# Altium schematic sheet DDR3B.SchDoc: HPBI Controller
size B; ApprovedBy: J Johnson; CheckedBy: J Johnson; Author: sdfasdfdfAEFfasdFfaF; DrawnBy: J Johnson; Organization: Opsero Electronic Design; Address1: 21-915 Av. Marguerite-Bourgeoys; Address2: Québec (QC); Address3: G1S 3X4; DocumentNumber: OP009-001-SCH; Revision: 1.0; SheetNumber: 04; SheetTotal: 16; Tel1: (581) 308-8830; Tel2: (581) 308-8830; Project: HPBI Controller; CheckedDate: 2013-12-13; Sheet: DDR3 SDRAM Page 2; PageSetup: Record=PageOptions|CenterHorizontal=True|CenterVertical=True|PrintScale=1.08|XCorrection=1.00|YCorrection=1.00|PrintKind=0|BorderSize=5000000|LeftOffset=0|BottomOffset=0|Orientation=2|PaperLength=1000|PaperWidth=1000|Scale=100|PaperSource=7|PrintQuality=-4|MediaType=1|DitherType=10|PaperKind=Tabloid     [11 x 17 in]|PrintScaleMode=1; DrawDate: 2013-12-13; SchTitle: HPBI Controller; RevDescription: Preliminary; RevDate: 2014-01-29; RevBy: J Johnson
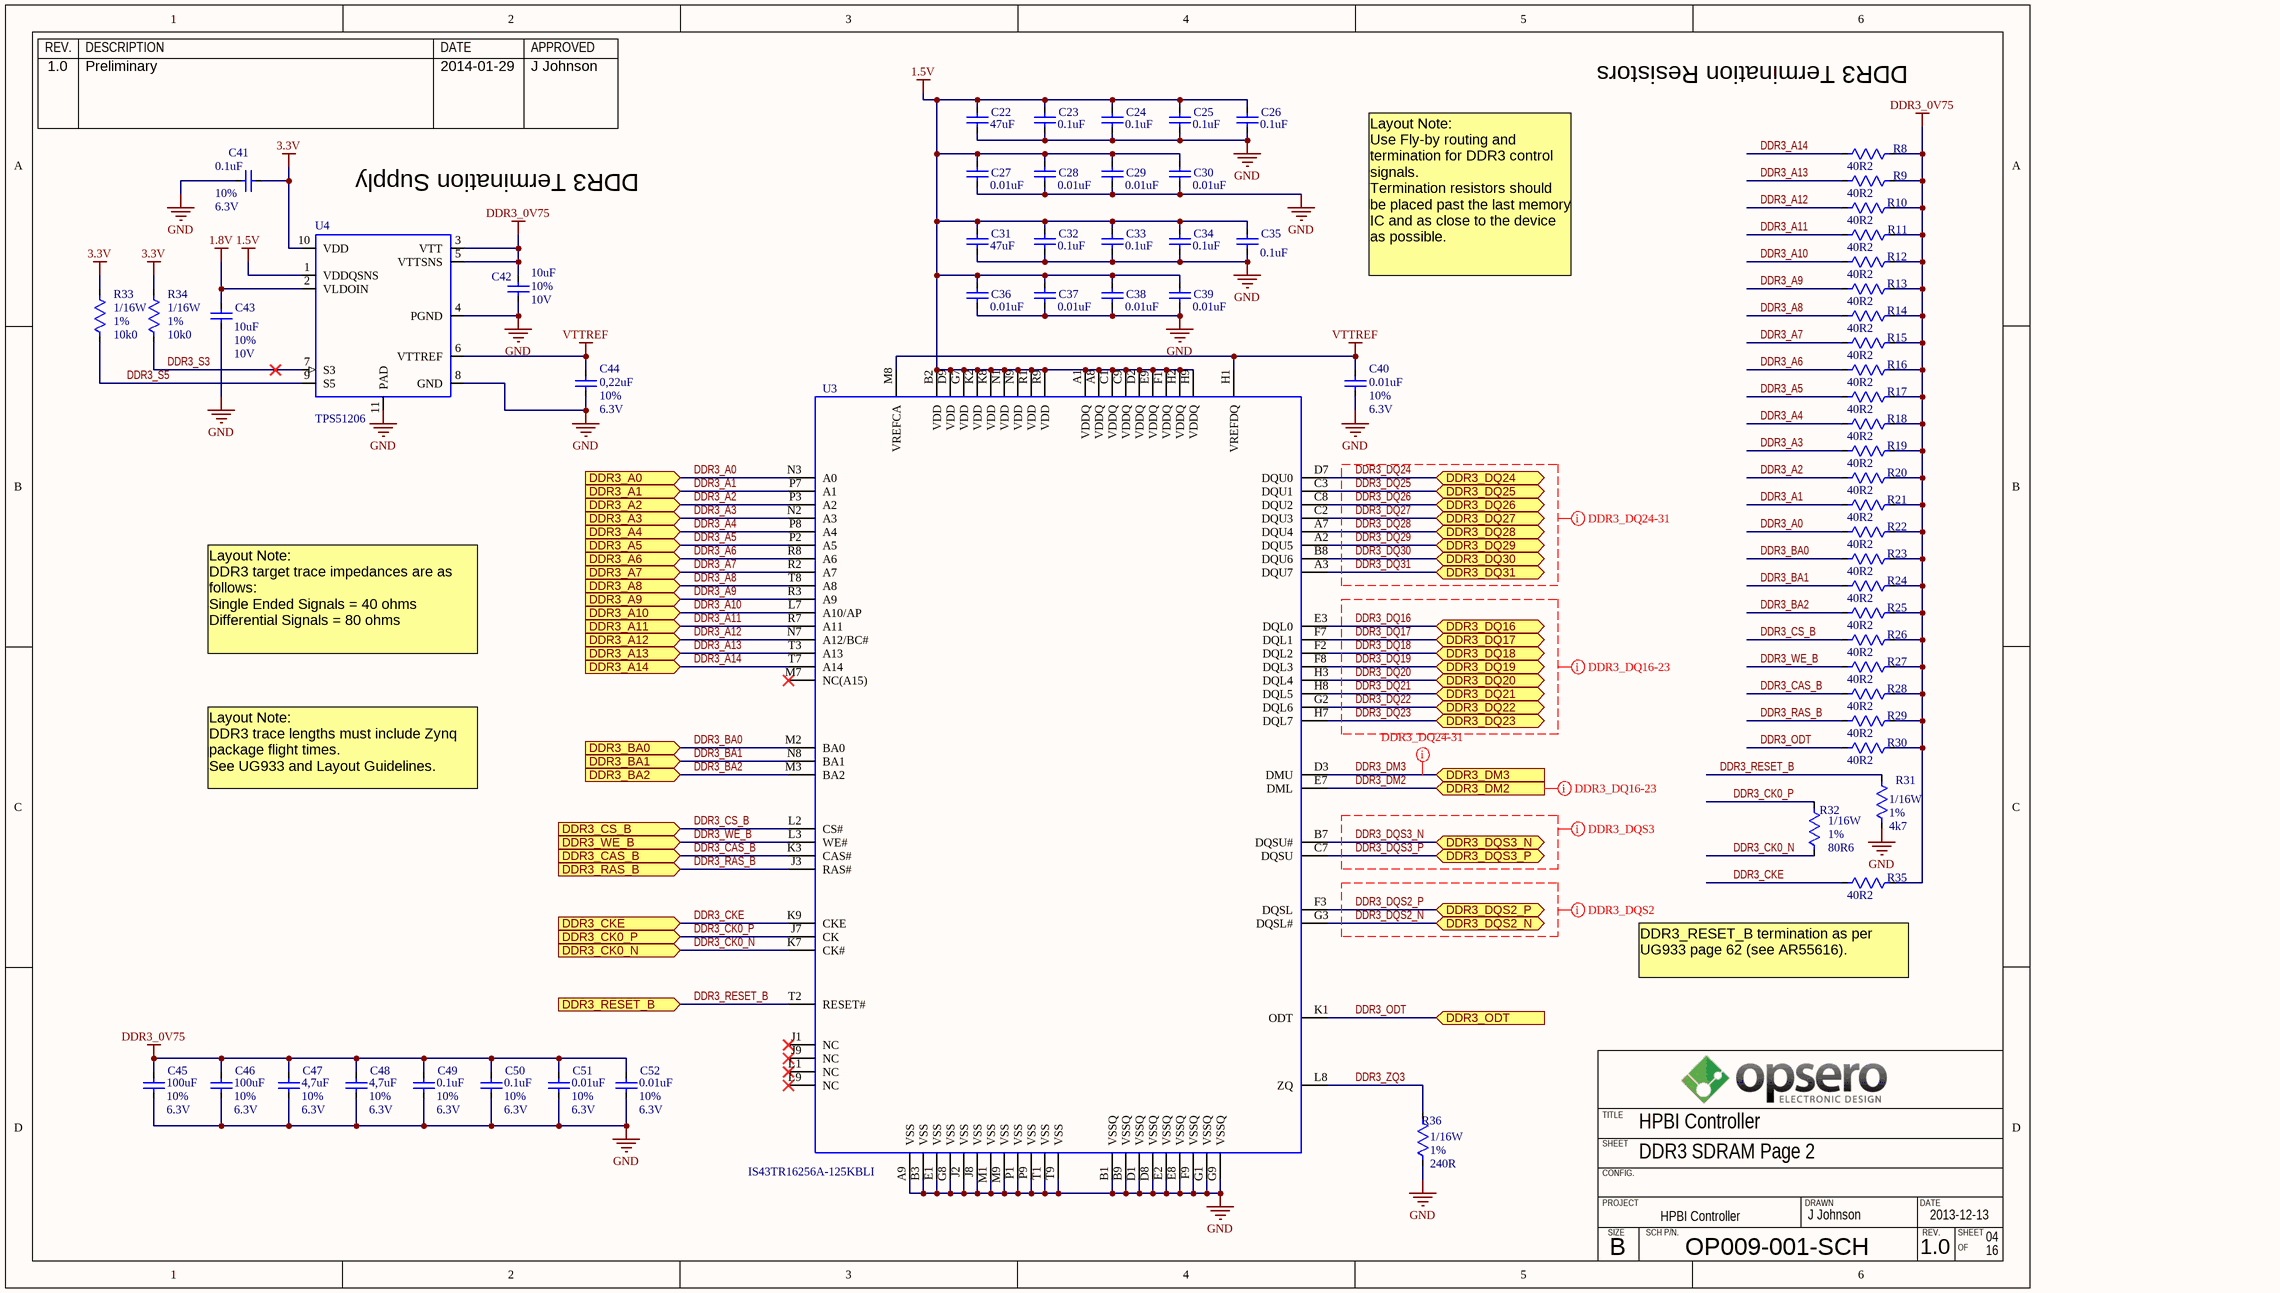
[diagram p0: DDR3B.SchDoc]

## Parts
C22  value 47uF  [CAPC2013X125N]  (hidden comment: CAPACITOR_NP_TYPE1)
C23  value 0.1uF  [CAPC0603X33N]  (hidden comment: CAPACITOR_NP_TYPE1)
C24  value 0.1uF  [CAPC0603X33N]  (hidden comment: CAPACITOR_NP_TYPE1)
C25  value 0.1uF  [CAPC0603X33N]  (hidden comment: CAPACITOR_NP_TYPE1)
C26  value 0.1uF  [CAPC0603X33N]  (hidden comment: CAPACITOR_NP_TYPE1)
C27  value 0.01uF  [CAPC0603X33N]  (hidden comment: CAPACITOR_NP_TYPE1)
C28  value 0.01uF  [CAPC0603X33N]  (hidden comment: CAPACITOR_NP_TYPE1)
C29  value 0.01uF  [CAPC0603X33N]  (hidden comment: CAPACITOR_NP_TYPE1)
C30  value 0.01uF  [CAPC0603X33N]  (hidden comment: CAPACITOR_NP_TYPE1)
C31  value 47uF  [CAPC2013X125N]  (hidden comment: CAPACITOR_NP_TYPE1)
C32  value 0.1uF  [CAPC0603X33N]  (hidden comment: CAPACITOR_NP_TYPE1)
C33  value 0.1uF  [CAPC0603X33N]  (hidden comment: CAPACITOR_NP_TYPE1)
C34  value 0.1uF  [CAPC0603X33N]  (hidden comment: CAPACITOR_NP_TYPE1)
C35  value 0.1uF  [CAPC0603X33N]  (hidden comment: CAPACITOR_NP_TYPE1)
C36  value 0.01uF  [CAPC0603X33N]  (hidden comment: CAPACITOR_NP_TYPE1)
C37  value 0.01uF  [CAPC0603X33N]  (hidden comment: CAPACITOR_NP_TYPE1)
C38  value 0.01uF  [CAPC0603X33N]  (hidden comment: CAPACITOR_NP_TYPE1)
C39  value 0.01uF  [CAPC0603X33N]  (hidden comment: CAPACITOR_NP_TYPE1)
C40  value 0.01uF  Tolerance: 10%  Voltage: 6.3V  [CAPC0603X33N]  (hidden comment: CAPACITOR_NP_TYPE1)
C41  value 0.1uF  Tolerance: 10%  Voltage: 6.3V  [CAPC0603X33N]  (hidden comment: CAPACITOR_NP_TYPE1)
C42  value 10uF  Tolerance: 10%  Voltage: 10V  [CAPC1608X38N]  (hidden comment: CAPACITOR_NP_TYPE1)
C43  value 10uF  Tolerance: 10%  Voltage: 10V  [CAPC1608X38N]  (hidden comment: CAPACITOR_NP_TYPE1)
C44  value 0,22uF  Tolerance: 10%  Voltage: 6.3V  [CAPC1005X55N]  (hidden comment: CAPACITOR_NP_TYPE1)
C45  value 100uF  Tolerance: 10%  Voltage: 6.3V  [CAPC3225X250N]  (hidden comment: CAPACITOR_NP_TYPE1)
C46  value 100uF  Tolerance: 10%  Voltage: 6.3V  [CAPC3225X250N]  (hidden comment: CAPACITOR_NP_TYPE1)
C47  value 4,7uF  Tolerance: 10%  Voltage: 6.3V  [CAPC1005X33N]  (hidden comment: CAPACITOR_NP_TYPE1)
C48  value 4,7uF  Tolerance: 10%  Voltage: 6.3V  [CAPC1005X33N]  (hidden comment: CAPACITOR_NP_TYPE1)
C49  value 0.1uF  Tolerance: 10%  Voltage: 6.3V  [CAPC0603X33N]  (hidden comment: CAPACITOR_NP_TYPE1)
C50  value 0.1uF  Tolerance: 10%  Voltage: 6.3V  [CAPC0603X33N]  (hidden comment: CAPACITOR_NP_TYPE1)
C51  value 0.01uF  Tolerance: 10%  Voltage: 6.3V  [CAPC0603X33N]  (hidden comment: CAPACITOR_NP_TYPE1)
C52  value 0.01uF  Tolerance: 10%  Voltage: 6.3V  [CAPC0603X33N]  (hidden comment: CAPACITOR_NP_TYPE1)
R8  value 40R2  [RESC1005X33N]  (hidden comment: *)
R9  value 40R2  [RESC1005X33N]  (hidden comment: *)
R10  value 40R2  [RESC1005X33N]  (hidden comment: *)
R11  value 40R2  [RESC1005X33N]  (hidden comment: *)
R12  value 40R2  [RESC1005X33N]  (hidden comment: *)
R13  value 40R2  [RESC1005X33N]  (hidden comment: *)
R14  value 40R2  [RESC1005X33N]  (hidden comment: *)
R15  value 40R2  [RESC1005X33N]  (hidden comment: *)
R16  value 40R2  [RESC1005X33N]  (hidden comment: *)
R17  value 40R2  [RESC1005X33N]  (hidden comment: *)
R18  value 40R2  [RESC1005X33N]  (hidden comment: *)
R19  value 40R2  [RESC1005X33N]  (hidden comment: *)
R20  value 40R2  [RESC1005X33N]  (hidden comment: *)
R21  value 40R2  [RESC1005X33N]  (hidden comment: *)
R22  value 40R2  [RESC1005X33N]  (hidden comment: *)
R23  value 40R2  [RESC1005X33N]  (hidden comment: *)
R24  value 40R2  [RESC1005X33N]  (hidden comment: *)
R25  value 40R2  [RESC1005X33N]  (hidden comment: *)
R26  value 40R2  [RESC1005X33N]  (hidden comment: *)
R27  value 40R2  [RESC1005X33N]  (hidden comment: *)
R28  value 40R2  [RESC1005X33N]  (hidden comment: *)
R29  value 40R2  [RESC1005X33N]  (hidden comment: *)
R30  value 40R2  [RESC1005X33N]  (hidden comment: *)
R31  value 4k7  Power: 1/16W  Tolerance: 1%  [RESC1005X33N]  (hidden comment: *)
R32  value 80R6  Power: 1/16W  Tolerance: 1%  [RESC1005X33N]  (hidden comment: *)
R33  value 10k0  Power: 1/16W  Tolerance: 1%  [RESC1005X33N]  (hidden comment: *)
R34  value 10k0  Power: 1/16W  Tolerance: 1%  [RESC1005X33N]  (hidden comment: *)
R35  value 40R2  [RESC1005X33N]  (hidden comment: *)
R36  value 240R  Power: 1/16W  Tolerance: 1%  [RESC1005X33N]  (hidden comment: *)
U3  IS43TR16256A-125KBLI  [BGA96C80P6X16_900X1300X120]
U4  TPS51206  [DFN40P200X200X75-11N]

## Ports
DDR3_A0 (in), DDR3_A1 (in), DDR3_A2 (in), DDR3_A3 (in), DDR3_A4 (in), DDR3_A5 (in), DDR3_A6 (in), DDR3_A7 (in), DDR3_A8 (in), DDR3_A9 (in), DDR3_A10 (in), DDR3_A11 (in), DDR3_A12 (in), DDR3_A13 (in), DDR3_A14 (in), DDR3_BA0 (in), DDR3_BA1 (in), DDR3_BA2 (in), DDR3_CAS_B (in), DDR3_CK0_N (in), DDR3_CK0_P (in), DDR3_CKE (in), DDR3_CS_B (in), DDR3_DM2 (in), DDR3_DM3 (in), DDR3_DQ16 (bidir), DDR3_DQ17 (bidir), DDR3_DQ18 (bidir), DDR3_DQ19 (bidir), DDR3_DQ20 (bidir), DDR3_DQ21 (bidir), DDR3_DQ22 (bidir), DDR3_DQ23 (bidir), DDR3_DQ24 (bidir), DDR3_DQ25 (bidir), DDR3_DQ26 (bidir), DDR3_DQ27 (bidir), DDR3_DQ28 (bidir), DDR3_DQ29 (bidir), DDR3_DQ30 (bidir), DDR3_DQ31 (bidir), DDR3_DQS2_N (bidir), DDR3_DQS2_P (bidir), DDR3_DQS3_N (bidir), DDR3_DQS3_P (bidir), DDR3_ODT (in), DDR3_RAS_B (in), DDR3_RESET_B (in), DDR3_WE_B (in)

## Nets
1.5V: C22.1 C23.1 C24.1 C25.1 C26.1 C27.1 C28.1 C29.1 C30.1 C31.1 C32.1 C33.1 C34.1 C35.1 C36.1 C37.1 C38.1 C39.1 U3.A1(VDDQ) U3.A8(VDDQ) U3.B2(VDD) U3.C1(VDDQ) U3.C9(VDDQ) U3.D2(VDDQ) U3.D9(VDD) U3.E9(VDDQ) U3.F1(VDDQ) U3.G7(VDD) U3.H2(VDDQ) U3.H9(VDDQ) U3.K2(VDD) U3.K8(VDD) U3.N1(VDD) U3.N9(VDD) U3.R1(VDD) U3.R9(VDD) U4.1(VDDQSNS)
1.8V: C43.1 U4.2(VLDOIN)
3.3V: C41.1 R33.1 R34.1 U4.10(VDD)
DDR3_0V75: C42.1 C45.1 C46.1 C47.1 C48.1 C49.1 C50.1 C51.1 C52.1 R8.1 R9.1 R10.1 R11.1 R12.1 R13.1 R14.1 R15.1 R16.1 R17.1 R18.1 R19.1 R20.1 R21.1 R22.1 R23.1 R24.1 R25.1 R26.1 R27.1 R28.1 R29.1 R30.1 R35.1 U4.3(VTT) U4.5(VTTSNS)
GND: C22.2 C23.2 C24.2 C25.2 C26.2 C27.2 C28.2 C29.2 C30.2 C31.2 C32.2 C33.2 C34.2 C35.2 C36.2 C37.2 C38.2 C39.2 C40.2 C41.2 C42.2 C43.2 C44.2 C45.2 C46.2 C47.2 C48.2 C49.2 C50.2 C51.2 C52.2 R31.2 R36.1 U3.A9(VSS) U3.B1(VSSQ) U3.B3(VSS) U3.B9(VSSQ) U3.D1(VSSQ) U3.D8(VSSQ) U3.E1(VSS) U3.E2(VSSQ) U3.E8(VSSQ) U3.F9(VSSQ) U3.G1(VSSQ) U3.G8(VSS) U3.G9(VSSQ) U3.J2(VSS) U3.J8(VSS) U3.M1(VSS) U3.M9(VSS) U3.P1(VSS) U3.P9(VSS) U3.T1(VSS) U3.T9(VSS) U4.4(PGND) U4.8(GND) U4.11(PAD)
VTTREF: C40.1 C44.1 U3.H1(VREFDQ) U3.M8(VREFCA) U4.6(VTTREF)
DDR3_A0: R22.2 U3.N3(A0) ; port DDR3_A0
DDR3_A1: R21.2 U3.P7(A1) ; port DDR3_A1
DDR3_A2: R20.2 U3.P3(A2) ; port DDR3_A2
DDR3_A3: R19.2 U3.N2(A3) ; port DDR3_A3
DDR3_A4: R18.2 U3.P8(A4) ; port DDR3_A4
DDR3_A5: R17.2 U3.P2(A5) ; port DDR3_A5
DDR3_A6: R16.2 U3.R8(A6) ; port DDR3_A6
DDR3_A7: R15.2 U3.R2(A7) ; port DDR3_A7
DDR3_A8: R14.2 U3.T8(A8) ; port DDR3_A8
DDR3_A9: R13.2 U3.R3(A9) ; port DDR3_A9
DDR3_A10: R12.2 U3.L7(A10/AP) ; port DDR3_A10
DDR3_A11: R11.2 U3.R7(A11) ; port DDR3_A11
DDR3_A12: R10.2 U3.N7(A12/BC#) ; port DDR3_A12
DDR3_A13: R9.2 U3.T3(A13) ; port DDR3_A13
DDR3_A14: R8.2 U3.T7(A14) ; port DDR3_A14
DDR3_BA0: R23.2 U3.M2(BA0) ; port DDR3_BA0
DDR3_BA1: R24.2 U3.N8(BA1) ; port DDR3_BA1
DDR3_BA2: R25.2 U3.M3(BA2) ; port DDR3_BA2
DDR3_CAS_B: R28.2 U3.K3(CAS#) ; port DDR3_CAS_B
DDR3_CK0_N: R32.1 U3.K7(CK#) ; port DDR3_CK0_N
DDR3_CK0_P: R32.2 U3.J7(CK) ; port DDR3_CK0_P
DDR3_CKE: R35.2 U3.K9(CKE) ; port DDR3_CKE
DDR3_CS_B: R26.2 U3.L2(CS#) ; port DDR3_CS_B
DDR3_DM2: U3.E7(DML) ; port DDR3_DM2
DDR3_DM3: U3.D3(DMU) ; port DDR3_DM3
DDR3_DQ16: U3.E3(DQL0) ; port DDR3_DQ16
DDR3_DQ17: U3.F7(DQL1) ; port DDR3_DQ17
DDR3_DQ18: U3.F2(DQL2) ; port DDR3_DQ18
DDR3_DQ19: U3.F8(DQL3) ; port DDR3_DQ19
DDR3_DQ20: U3.H3(DQL4) ; port DDR3_DQ20
DDR3_DQ21: U3.H8(DQL5) ; port DDR3_DQ21
DDR3_DQ22: U3.G2(DQL6) ; port DDR3_DQ22
DDR3_DQ23: U3.H7(DQL7) ; port DDR3_DQ23
DDR3_DQ24: U3.D7(DQU0) ; port DDR3_DQ24
DDR3_DQ25: U3.C3(DQU1) ; port DDR3_DQ25
DDR3_DQ26: U3.C8(DQU2) ; port DDR3_DQ26
DDR3_DQ27: U3.C2(DQU3) ; port DDR3_DQ27
DDR3_DQ28: U3.A7(DQU4) ; port DDR3_DQ28
DDR3_DQ29: U3.A2(DQU5) ; port DDR3_DQ29
DDR3_DQ30: U3.B8(DQU6) ; port DDR3_DQ30
DDR3_DQ31: U3.A3(DQU7) ; port DDR3_DQ31
DDR3_DQS2_N: U3.G3(DQSL#) ; port DDR3_DQS2_N
DDR3_DQS2_P: U3.F3(DQSL) ; port DDR3_DQS2_P
DDR3_DQS3_N: U3.B7(DQSU#) ; port DDR3_DQS3_N
DDR3_DQS3_P: U3.C7(DQSU) ; port DDR3_DQS3_P
DDR3_ODT: R30.2 U3.K1(ODT) ; port DDR3_ODT
DDR3_RAS_B: R29.2 U3.J3(RAS#) ; port DDR3_RAS_B
DDR3_RESET_B: R31.1 U3.T2(RESET#) ; port DDR3_RESET_B
DDR3_S3: R34.2 U4.7(S3)
DDR3_S5: R33.2 U4.9(S5)
DDR3_WE_B: R27.2 U3.L3(WE#) ; port DDR3_WE_B
DDR3_ZQ3: R36.2 U3.L8(ZQ)

Not connected (* = marked no-connect by the designer): U3 J1(NC)* J9(NC)* L1(NC)* L9(NC)* M7(NC(A15))*

## Layout directives
net class DDR3_DQ3(24-31): DDR3_DM3, DDR3_DQ24, DDR3_DQ25, DDR3_DQ26, DDR3_DQ27, DDR3_DQ28, DDR3_DQ29, DDR3_DQ30, DDR3_DQ31
net class DDR3_DQ2(16-23): DDR3_DM2, DDR3_DQ16, DDR3_DQ17, DDR3_DQ18, DDR3_DQ19, DDR3_DQ20, DDR3_DQ21, DDR3_DQ22, DDR3_DQ23
net class DDR3_DQS3: DDR3_DQS3_N, DDR3_DQS3_P
net class DDR3_DQS2: DDR3_DQS2_N, DDR3_DQS2_P

## Notes on the sheet
- DDR3 Termination Resistors
- DDR3 Termination Supply
- Layout Note:
  Use Fly-by routing and termination for DDR3 control signals.
  Termination resistors should be placed past the last memory IC and as close to the device as possible.
- Layout Note:
  DDR3 target trace impedances are as follows:
  Single Ended Signals = 40 ohms
  Differential Signals = 80 ohms
- Layout Note:
  DDR3 trace lengths must include Zynq package flight times.
  See UG933 and Layout Guidelines.
- (near R35) DDR3_RESET_B termination as per UG933 page 62 (see AR55616).
- REV.
- DESCRIPTION
- DATE
- APPROVED
- SHEET
- TITLE
- CONFIG.
- PROJECT
- SIZE
- SCH P/N.
- DRAWN
- B
- OF

## Library data of the parts
C22 C31 = C0805_47uF_10%_25V_X5R: Capacitor ceramic, X5R, 47uF, 6.3V, 20%, -55 to +85 C,; Manufacturer 1: Taiyo; Mfg Part Number 1: JMK212BJ476MG-T; EIA(I) Package: 0805; EIA(M) Package: 2012; ASSY: USED; Status: Active; Power: *; Current: *; Part Ref: C0805_47uF_10%_25V_X5R; Comment_1: *; RoHs: True; Tolerance: 20%; Voltage: 6.3V; Operating Temp: -55 to +85 C
C23-C26 C32-C35 C41 C49 C50 = C0201_0.1uF_10%_6.3V_X5R: Capacitor ceramic, X5R, 0.1uF, 6.3V, 10%, -55 to +125 C, EIA0201; Manufacturer 1: Murata; Mfg Part Number 1: GRM033R60J104KE19D; EIA(I) Package: 0201; EIA(M) Package: 0603; ASSY: USED; Status: Active; Power: *; Current: *; Part Ref: C0201_0.1uF_10%_6.3V_X5R; Comment_1: *; RoHs: True; Operating Temp: -55 to +85 C
  C23-C26 C32-C35: Tolerance: 10%; Voltage: 6.3V
C27-C30 C36-C40 C51 C52 = C0201_0.01uF_10%_6.3V_X5R: Capacitor ceramic, X5R, 0.01uF, 6.3V, 10%, -55 to +125 C, EIA0201; Manufacturer 1: Murata; Mfg Part Number 1: GRM033R60J103KA01D; EIA(I) Package: 0201; EIA(M) Package: 0603; ASSY: USED; Status: Active; Power: *; Current: *; Part Ref: C0201_0.01uF_10%_6.3V_X5R; Comment_1: *; RoHs: True; Operating Temp: -55 to +85 C
  C27-C30 C36-C39: Tolerance: 10%; Voltage: 6.3V
C42 C43 = C0603_10uF_10%_10V_X5R: Capacitor ceramic, X5R, 10uF, 10V, 10%, -55 to +85 C, EIA0603; Manufacturer 1: TDK Corporation; Mfg Part Number 1: C1608X5R1A106K080AC; EIA(I) Package: 0603; EIA(M) Package: 1608; ASSY: USED; Status: Active; Power: *; Current: *; Part Ref: C0603_10uF_10%_10V_X5R; Comment_1: *; RoHs: True; Operating Temp: -55 to +85 C
C44 = C0402_0.22uF_10%_6.3V_X5R: Capacitor ceramic, X5R, 0.22uF, 6.3V, 10%, -55 to +85 C, EIA0402; Manufacturer 1: AVX; Mfg Part Number 1: 04026D224KAT2A; EIA(I) Package: 0402; EIA(M) Package: 1005; ASSY: USED; Status: Active; Power: *; Current: *; Part Ref: C0402_0.22uF_10%_6.3V_X5R; Comment_1: *; RoHs: True; Operating Temp: -55 to +85 C
C45 C46 = C1210_100uF_10%_6.3V_X5R: Capacitor ceramic, X5R, 100uF, 6.3V, 10%, -55 to +85 C, EIA1210; Manufacturer 1: Murata; Mfg Part Number 1: GRM32EF50J107ZE20K; EIA(I) Package: 1210; EIA(M) Package: 3225; ASSY: USED; Status: Active; Power: *; Current: *; Part Ref: C1210_100uF_10%_6.3V_X5R; Comment_1: *; RoHs: True; Operating Temp: -55 to +85 C; Datasheet 1: ..\datasheet\Capacitor\Murata\GRM_Serie\GRM32ER60J_X5R\2012-10-25
C47 C48 = C0402_4.7uF_20%_6.3V_X7R: Capacitor ceramic, X5R, 4,7uF, 6.3V, 10%, -55 to +85 C, EIA0402; Manufacturer 1: TDK; Mfg Part Number 1: C1005X5R0J475K; EIA(I) Package: 0402; EIA(M) Package: 1005; ASSY: USED; Status: Active; Power: *; Current: *; Part Ref: C0402_4.7uF_20%_6.3V_X7R; Comment_1: *; RoHs: True; Operating Temp: -55 to +85 C; Datasheet 1: ..\datasheet\Capacitor\TDK\C Series\2012-10-25
R8-R30 R35 = R0402_40R2_1%: Resistor, 40R2, 1/16W, 1%, -50 to +155 C, EIA0402, EIA(M)1005; Manufacturer 1: Yageo; Mfg Part Number 1: RC0402FR-0740R2L; EIA(I) Package: 0402; EIA(M) Package: 1005; Voltage: 50V; ASSY: USED; Status: Active; Part Ref: R0402_40R2_1%; Current: *; Comment_1: *; RoHs: True; Power: 1/16W; Tolerance: 1%; Operating Temp: -50 to +155 C; Datasheet 1: ..\datasheet\Resistor\Yaego\Thick_Film\RC0402\2012-03-29; Manufacturer 2: Vishay Dale; Mfg Part Number 2: CRCW040240R2FKED; Datasheet 2: ..\datasheet\Resistor\Vishay Dale\CRC\2012-03-29
R31 = R0402_4k70_1%: Resistor, 4k7, 1/16W, 1%, -55 to +155 C, EIA0402; Manufacturer 1: Yageo; Mfg Part Number 1: RC0402FR-074k7L; EIA(I) Package: 0402; EIA(M) Package: 1005; Voltage: 50V; ASSY: USED; Status: Active; Part Ref: R0402_4k70_1%; Current: *; Comment_1: *; RoHs: True; Operating Temp: -55 to +155 C; Datasheet 1: ..\datasheet\Resistor\Yaego\Thick_Film\RC0402\2012-03-29; Manufacturer 2: Vishay Dale; Mfg Part Number 2: CRCW04024k70FKED; Datasheet 2: ..\datasheet\Resistor\Vishay Dale\CRC\2012-03-29
R32 = R0402_80R6_1%: Resistor, 80R6, 1/16W, 1%, -50 to +155 C, EIA0402, EIA(M)1005; Manufacturer 1: Yageo; Mfg Part Number 1: RC0402FR-0780R6L; EIA(I) Package: 0402; EIA(M) Package: 1005; Voltage: 50V; ASSY: USED; Status: Active; Part Ref: R0402_80R6_1%; Current: *; Comment_1: *; RoHs: True; Operating Temp: -50 to +155 C; Datasheet 1: ..\datasheet\Resistor\Yaego\Thick_Film\RC0402\2012-03-29; Manufacturer 2: Vishay Dale; Mfg Part Number 2: CRCW040280R6FKED; Datasheet 2: ..\datasheet\Resistor\Vishay Dale\CRC\2012-03-29
R33 R34 = R0402_10k0_1%: Resistor, 10k0, 1/16W, 1%, -55 to +155 C, EIA0402; Manufacturer 1: Yageo; Mfg Part Number 1: RC0402FR-0710k0L; EIA(I) Package: 0402; EIA(M) Package: 1005; Voltage: 50V; ASSY: USED; Status: Active; Part Ref: R0402_10k0_1%; Current: *; Comment_1: *; RoHs: True; Package: 0402; Operating Temp: -55 to +155 C; Datasheet 1: ..\datasheet\Resistor\Yaego\Thick_Film\RC0402\2012-03-29; Manufacturer 2: Vishay Dale; Mfg Part Number 2: CRCW040210k0FKED; Datasheet 2: ..\datasheet\Resistor\Vishay Dale\CRC\2012-03-29
R36 = R0402_240R_1%: Resistor, 240R, 1/16W, 1%, -50 to +155 C, EIA0402, EIA(M)1005; Manufacturer 1: Vishay Dale; Mfg Part Number 1: CRCW0402240RFKED; EIA(I) Package: 0402; EIA(M) Package: 1005; Voltage: 50V; ASSY: USED; Status: Active; Part Ref: R0402_240R_1%; Current: *; Comment_1: *; RoHs: True; Operating Temp: -50 to +155 C
U4 = TPS51206: DDR Termination Regulator, -40 to +85 C; Manufacturer 1: Texas Instruments; Mfg Part Number 1: TPS51206DSQT; Voltage: 3.3V or 5V; Current: 2A; PART NUMBER: TPS51206; Part Ref: TPS51206; Status: Active; RoHs: True; Value: TPS51206; Operating Temp: -40 to +85 C
U3 = IS43TR16256A-125KBLI: PART NUMBER: IS43TR16256A-125KBLI; Part Ref: IS43TR16256A-125KBLI; Status: Active; RoHs: False; Value: IS43TR16256A-125KBLI; Mfg Part Number 1: IS43TR16256A-125KBLI